# Altium schematic sheet Modulo_de_apertura_CPU.SchDoc
size A4; SheetNumber: 4; SheetTotal: 4
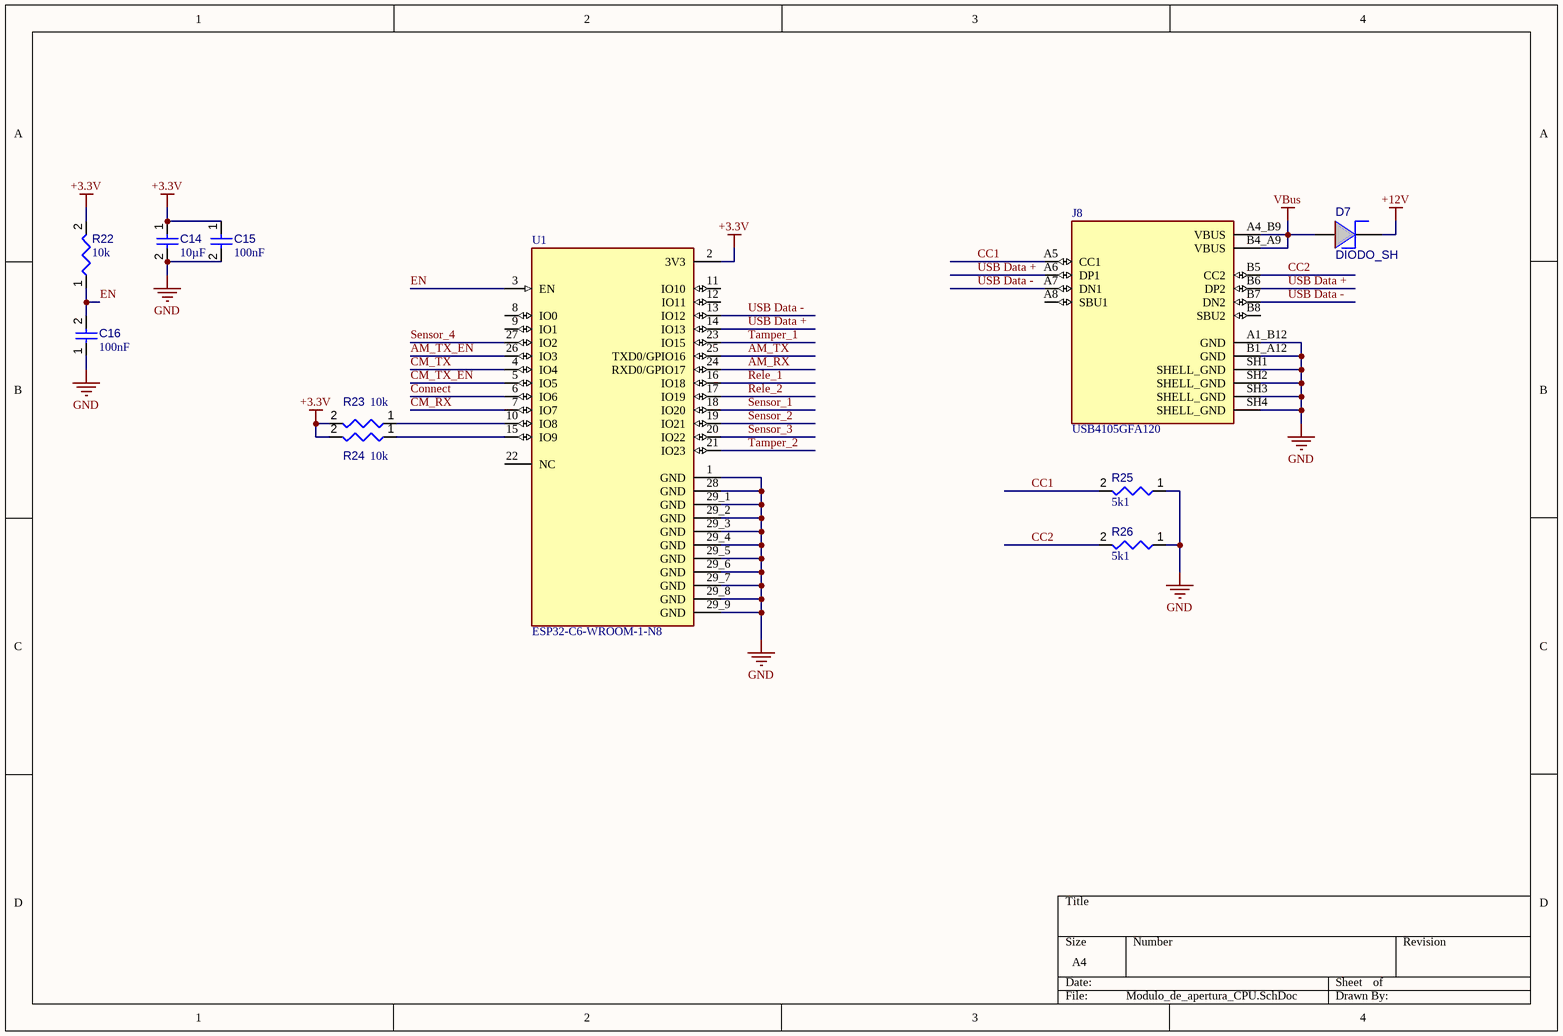
[diagram p0: Modulo_de_apertura_CPU.SchDoc]

## Parts
C14  value 10µF  [CAPC0603(1608)100_L]  (hidden comment: Capacitor 10µF +/-20% 10V 0603)
C15  value 100nF  [CAPC0402(1005)60_L]  (hidden comment: Capacitor 100nF +/-20% 10V 0402)
C16  value 100nF  [CAPC0402(1005)33_L]  (hidden comment: Capacitor 12pF +/-10% 50V 0402)
D7  DIODO_SH  [D_SMA]
J8  USB4105GFA120  [GCT_USB4105GFA120]
R22  value 10k  [RESC0402(1005)_L]  (hidden comment: Resistor 10K  +/-1 % 0402 63 mW)
R23  value 10k  [RESC0402(1005)_L]  (hidden comment: Resistor 10K  +/-1 % 0402 63 mW)
R24  value 10k  [RESC0402(1005)_L]  (hidden comment: Resistor 10K  +/-1 % 0402 63 mW)
R25  value 5k1  [RESC0402(1005)_L]  (hidden comment: Resistor 10K  +/-1 % 0402 63 mW)
R26  value 5k1  [RESC0402(1005)_L]  (hidden comment: Resistor 10K  +/-1 % 0402 63 mW)
U1  ESP32-C6-WROOM-1-N8  [XCVR_ESP32-C6-WROOM-1-N8]

## Nets
+3.3V: C14.1 C15.1 R22.2 R23.2 R24.2 U1.2(3V3)
+12V: D7.2(K)
GND: C14.2 C15.2 C16.1 J8.A1_B12(GND) J8.B1_A12(GND) J8.SH1(SHELL_GND) J8.SH2(SHELL_GND) J8.SH3(SHELL_GND) J8.SH4(SHELL_GND) R25.1 R26.1 U1.1(GND) U1.28(GND) U1.29_1(GND) U1.29_2(GND) U1.29_3(GND) U1.29_4(GND) U1.29_5(GND) U1.29_6(GND) U1.29_7(GND) U1.29_8(GND) U1.29_9(GND)
VBus: D7.1(A) J8.A4_B9(VBUS) J8.B4_A9(VBUS)
AM_RX: U1.24(RXD0/GPIO17)
AM_TX: U1.25(TXD0/GPIO16)
AM_TX_EN: U1.26(IO3)
CC1: J8.A5(CC1) R25.2
CC2: J8.B5(CC2) R26.2
CM_RX: U1.7(IO7)
CM_TX: U1.4(IO4)
CM_TX_EN: U1.5(IO5)
Connect: U1.6(IO6)
EN: C16.2 R22.1 U1.3(EN)
Rele_1: U1.16(IO18)
Rele_2: U1.17(IO19)
Sensor_1: U1.18(IO20)
Sensor_2: U1.19(IO21)
Sensor_3: U1.20(IO22)
Sensor_4: U1.27(IO2)
Tamper_1: U1.23(IO15)
Tamper_2: U1.21(IO23)
USB Data +: J8.A6(DP1) J8.B6(DP2) U1.14(IO13)
USB Data -: J8.A7(DN1) J8.B7(DN2) U1.13(IO12)
NetR23_1: R23.1 U1.10(IO8)
NetR24_1: R24.1 U1.15(IO9)

Not connected (* = marked no-connect by the designer): J8 A8(SBU1) B8(SBU2); U1 8(IO0) 9(IO1) 11(IO10) 12(IO11) 22(NC)

## Library data of the parts
C14 = CMP-001-00075-4: Chip Capacitor, 10µF +/-20%, 10V, 0603, Thickness 1 mm; Tolerance: 10%; Voltage Rating: 10V; Max Operating Temperature: 85°C; Pins: 2; Case/Package: 0603; Mounting Technology: SMT; Min Operating Temperature: -55°C
C15 = CMP-001-00061-3: Chip Capacitor, 100nF +/-20%, 10V, 0402, Thickness 0.6 mm; Tolerance: 20%; Mounting Technology: SMT; Voltage Rating: 10V; Max Operating Temperature: 85°C; Pins: 2; Case/Package: 0402; Min Operating Temperature: -55°C
C16 = CMP-001-00072-4: Chip Capacitor, 12pF +/-10%, 50V, 0402, Thickness 0.33 mm; Tolerance: 20%; Pins: 2; Max Operating Temperature: 85°C; Case/Package: 0402; Voltage Rating: 50V; Mounting Technology: SMT; Min Operating Temperature: -55°C
D7 = DIODO_SH: Diode Shottky
J8 = USB4105GFA120: USB CONN, 2.0 TYPE C, RCPT, 16POS, SMT; USB Connector Type:USB Type C; USB Standard:USB 2.0; Gender:Receptacle; No. of Positions:16Positions; Connector Mounting:Surface Mount, Through Hole Mount; Orientation:Right Angle RoHS Compliant: Yes; MF: Global Connector Technology; SnapEDA_Link: https://www.snapeda.com/parts/USB4105GFA120/Global+Connector+Technology/view-part/?ref=snap; Package: None; Value: *; MP: USB4105GFA120; Check_prices: https://www.snapeda.com/parts/USB4105GFA120/Global+Connector+Technology/view-part/?ref=eda
R22-R26 = CMP-009-00149-3: Chip Resistor, 10 kOhms, +/-1 %, 63 mW, -55 to 125 degC, 0402; Power: 63mW; Tolerance: 1%; Min Operating Temperature: -55°C; Case/Package: 0402; Max Operating Temperature: 155°C; Pins: 2
U1 = ESP32-C6-WROOM-1-N8: Multiprotocol Modules ESP32-C6 module, Wi-Fi 6 in 2.4 GHz band, Bluetooth 5, Zigbee 3.0 and Thread. ESP34-WROOM Compatible - ENGINEERING SAMPLE; MF: Espressif Systems; SnapEDA_Link: https://www.snapeda.com/parts/ESP32-C6-WROOM-1-N8/Espressif+Systems/view-part/?ref=snap; Package: SMD-28 Espressif Systems; Value: *; MP: ESP32-C6-WROOM-1-N8; Check_prices: https://www.snapeda.com/parts/ESP32-C6-WROOM-1-N8/Espressif+Systems/view-part/?ref=eda